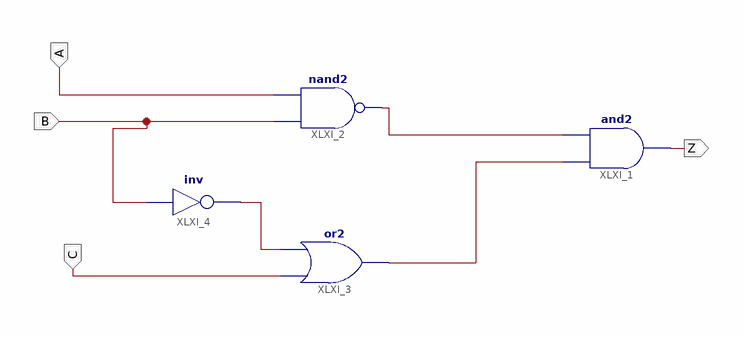
[diagram p0: schematic sheet 1]
// Xilinx ISE schematic p1ej3a.sch (spartan3) as structural Verilog: 4 symbols, 4 ports
module p1ej3a (
  input  B,
  input  A,
  input  C,
  output Z
);

  wire XLXN_1, XLXN_3, XLXN_4;

  and XLXI_1 (Z, XLXN_4, XLXN_3);
  nand XLXI_2 (XLXN_3, B, A);
  or XLXI_3 (XLXN_4, C, XLXN_1);
  not XLXI_4 (XLXN_1, B);
endmodule
